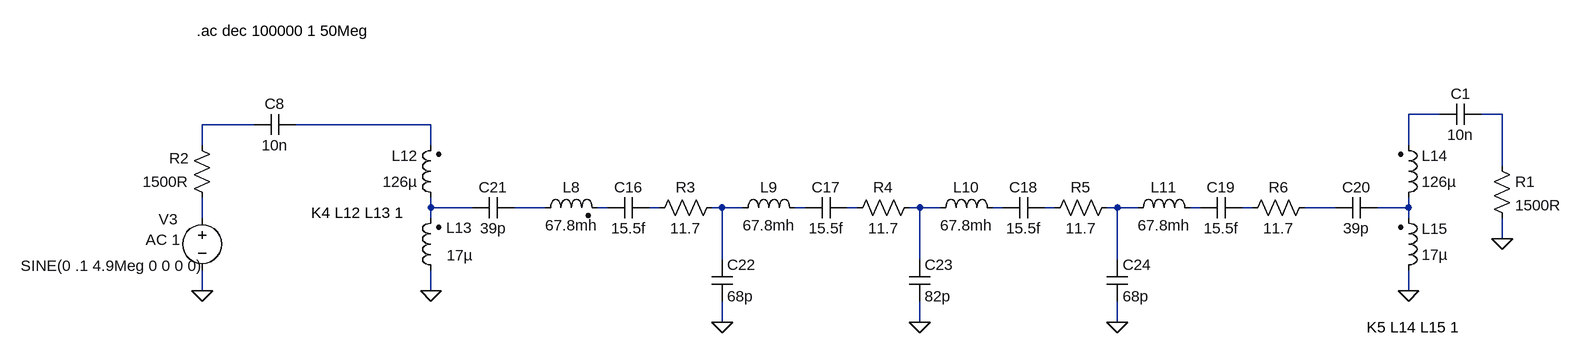
[diagram p0: schematic Crystal Filter VE3OOI Testing.asc]
Crystal Filter VE3OOI Testing.asc, the LTspice schematic file:
Version 4
SHEET 1 1208 680
WIRE 864 -80 816 -80
WIRE 960 -80 928 -80
WIRE -960 -64 -1040 -64
WIRE -688 -64 -896 -64
WIRE -1040 -32 -1040 -64
WIRE -688 -32 -688 -64
WIRE 816 -32 816 -80
WIRE 960 0 960 -80
WIRE -688 64 -688 48
WIRE -624 64 -688 64
WIRE -512 64 -560 64
WIRE -416 64 -432 64
WIRE -336 64 -352 64
WIRE -240 64 -256 64
WIRE -208 64 -240 64
WIRE -112 64 -128 64
WIRE -32 64 -48 64
WIRE 64 64 48 64
WIRE 96 64 64 64
WIRE 192 64 176 64
WIRE 272 64 256 64
WIRE 368 64 352 64
WIRE 400 64 368 64
WIRE 496 64 480 64
WIRE 576 64 560 64
WIRE 704 64 656 64
WIRE 816 64 816 48
WIRE 816 64 768 64
WIRE -1040 80 -1040 48
WIRE -688 80 -688 64
WIRE 816 80 816 64
WIRE 960 112 960 80
WIRE -240 144 -240 64
WIRE 64 144 64 64
WIRE 368 144 368 64
WIRE -1040 192 -1040 160
WIRE -688 192 -688 160
WIRE 816 192 816 160
WIRE -240 240 -240 208
WIRE 64 240 64 208
WIRE 368 240 368 208
FLAG -1040 192 0
FLAG 368 240 0
FLAG 64 240 0
FLAG -240 240 0
FLAG -688 192 0
FLAG 816 192 0
FLAG 960 112 0
SYMBOL cap -896 -80 R90
WINDOW 0 0 32 VBottom 2
WINDOW 3 32 32 VTop 2
SYMATTR InstName C8
SYMATTR Value 10n
SYMBOL res -1024 64 R180
WINDOW 0 36 76 Left 2
WINDOW 3 36 40 Left 2
SYMATTR InstName R2
SYMATTR Value 1500R
SYMBOL voltage -1040 64 R0
WINDOW 123 -87 49 Left 2
WINDOW 39 0 0 Left 2
WINDOW 0 -67 18 Left 2
WINDOW 3 -279 89 Left 2
SYMATTR Value2 AC 1
SYMATTR InstName V3
SYMATTR Value SINE(0 .1 4.9Meg 0 0 0 0)
SYMBOL ind2 -528 80 R270
WINDOW 0 32 56 VTop 2
WINDOW 3 5 56 VBottom 2
SYMATTR InstName L8
SYMATTR Value 67.8mh
SYMATTR Type ind
SYMBOL cap -352 48 R90
WINDOW 0 0 32 VBottom 2
WINDOW 3 32 32 VTop 2
SYMATTR InstName C16
SYMATTR Value 15.5f
SYMBOL res -240 48 R90
WINDOW 0 0 56 VBottom 2
WINDOW 3 32 56 VTop 2
SYMATTR InstName R3
SYMATTR Value 11.7
SYMBOL ind -224 80 R270
WINDOW 0 32 56 VTop 2
WINDOW 3 5 56 VBottom 2
SYMATTR InstName L9
SYMATTR Value 67.8mh
SYMBOL cap -48 48 R90
WINDOW 0 0 32 VBottom 2
WINDOW 3 32 32 VTop 2
SYMATTR InstName C17
SYMATTR Value 15.5f
SYMBOL res 64 48 R90
WINDOW 0 0 56 VBottom 2
WINDOW 3 32 56 VTop 2
SYMATTR InstName R4
SYMATTR Value 11.7
SYMBOL ind 80 80 R270
WINDOW 0 32 56 VTop 2
WINDOW 3 5 56 VBottom 2
SYMATTR InstName L10
SYMATTR Value 67.8mh
SYMBOL cap 256 48 R90
WINDOW 0 0 32 VBottom 2
WINDOW 3 32 32 VTop 2
SYMATTR InstName C18
SYMATTR Value 15.5f
SYMBOL res 368 48 R90
WINDOW 0 0 56 VBottom 2
WINDOW 3 32 56 VTop 2
SYMATTR InstName R5
SYMATTR Value 11.7
SYMBOL ind 384 80 R270
WINDOW 0 32 56 VTop 2
WINDOW 3 5 56 VBottom 2
SYMATTR InstName L11
SYMATTR Value 67.8mh
SYMBOL cap 560 48 R90
WINDOW 0 0 32 VBottom 2
WINDOW 3 32 32 VTop 2
SYMATTR InstName C19
SYMATTR Value 15.5f
SYMBOL res 672 48 R90
WINDOW 0 0 56 VBottom 2
WINDOW 3 32 56 VTop 2
SYMATTR InstName R6
SYMATTR Value 11.7
SYMBOL cap 704 80 R270
WINDOW 0 32 32 VTop 2
WINDOW 3 0 32 VBottom 2
SYMATTR InstName C20
SYMATTR Value 39p
SYMBOL cap -624 80 R270
WINDOW 0 32 32 VTop 2
WINDOW 3 0 32 VBottom 2
SYMATTR InstName C21
SYMATTR Value 39p
SYMBOL cap -256 144 R0
SYMATTR InstName C22
SYMATTR Value 68p
SYMBOL cap 48 144 R0
SYMATTR InstName C23
SYMATTR Value 82p
SYMBOL cap 352 144 R0
SYMATTR InstName C24
SYMATTR Value 68p
SYMBOL ind2 -672 64 R180
WINDOW 0 36 80 Left 2
WINDOW 3 36 40 Left 2
SYMATTR InstName L12
SYMATTR Value 126µ
SYMATTR Type ind
SYMBOL ind2 -672 176 R180
WINDOW 0 -48 81 Left 2
WINDOW 3 -49 39 Left 2
SYMATTR InstName L13
SYMATTR Value 17µ
SYMATTR Type ind
SYMBOL ind2 800 64 M180
WINDOW 0 36 80 Left 2
WINDOW 3 36 40 Left 2
SYMATTR InstName L14
SYMATTR Value 126µ
SYMATTR Type ind
SYMBOL ind2 800 176 M180
WINDOW 0 36 80 Left 2
WINDOW 3 36 40 Left 2
SYMATTR InstName L15
SYMATTR Value 17µ
SYMATTR Type ind
SYMBOL res 944 -16 R0
SYMATTR InstName R1
SYMATTR Value 1500R
SYMBOL cap 928 -96 R90
WINDOW 0 0 32 VBottom 2
WINDOW 3 32 32 VTop 2
SYMATTR InstName C1
SYMATTR Value 10n
TEXT -872 72 Left 2 !K4 L12 L13 1
TEXT 752 248 Left 2 !K5 L14 L15 1
TEXT -1048 -208 Left 2 !.ac dec 100000 1 50Meg

The netlist it stands for:
* Crystal Filter VE3OOI Testing.asc
C8 N004 N003 10n
R2 N020 N003 1500R
V3 N020 0 SINE(0 .1 4.9Meg 0 0 0 0) AC 1
L8 N006 N007 67.8mh
C16 N008 N007 15.5f
R3 N009 N008 11.7
L9 N009 N010 67.8mh
C17 N011 N010 15.5f
R4 N012 N011 11.7
L10 N012 N013 67.8mh
C18 N014 N013 15.5f
R5 N015 N014 11.7
L11 N015 N016 67.8mh
C19 N017 N016 15.5f
R6 N018 N017 11.7
C20 N018 N019 39p
C21 N005 N006 39p
C22 N009 0 68p
C23 N012 0 82p
C24 N015 0 68p
L12 N005 N004 126µ
L13 0 N005 17µ
L14 N019 N001 126µ
L15 0 N019 17µ
R1 N002 0 1500R
C1 N002 N001 10n
K4 L12 L13 1
K5 L14 L15 1
.ac dec 100000 1 50Meg
.backanno
.end